# EAGLE schematic hld (EAGLE 6.3)
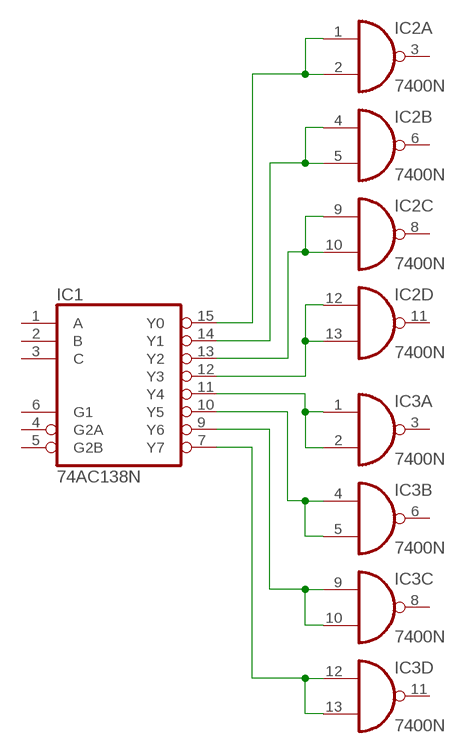
[diagram p0: schematic, sheet 1]

## Parts
IC1  74AC138N  [DIL16]
IC2  7400N  [DIL14]
IC3  7400N  [DIL14]

## Nets
N$1: IC1.15(Y0) IC2.1(A:I0) IC2.2(A:I1)
N$2: IC1.14(Y1) IC2.4(B:I0) IC2.5(B:I1)
N$3: IC1.13(Y2) IC2.9(C:I0) IC2.10(C:I1)
N$4: IC1.12(Y3) IC2.12(D:I0) IC2.13(D:I1)
N$5: IC1.11(Y4) IC3.1(A:I0) IC3.2(A:I1)
N$6: IC1.10(Y5) IC3.4(B:I0) IC3.5(B:I1)
N$7: IC1.9(Y6) IC3.9(C:I0) IC3.10(C:I1)
N$8: IC1.7(Y7) IC3.12(D:I0) IC3.13(D:I1)
Unconnected: IC1.1(A) IC1.2(B) IC1.3(C) IC1.4(G2A) IC1.5(G2B) IC1.6(G1) IC2.3(A:O) IC2.6(B:O) IC2.8(C:O) IC2.11(D:O) IC3.3(A:O) IC3.6(B:O) IC3.8(C:O) IC3.11(D:O)

## Power pins joined to a net without a drawn wire
GND: IC1.8(GND) IC2.7(P:GND) IC3.7(P:GND)
VCC: IC1.16(VCC) IC2.14(P:VCC) IC3.14(P:VCC)

## Library data of the parts
IC1 = 74xx-eu:74*138: 3-line to 8-line DECODER/DEMULTIPLEXER
IC2 IC3 = 74xx-eu:74*00: Quad 2-input NAND gate